# Altium project MB1430.PrjPcb (part 1 of 2)
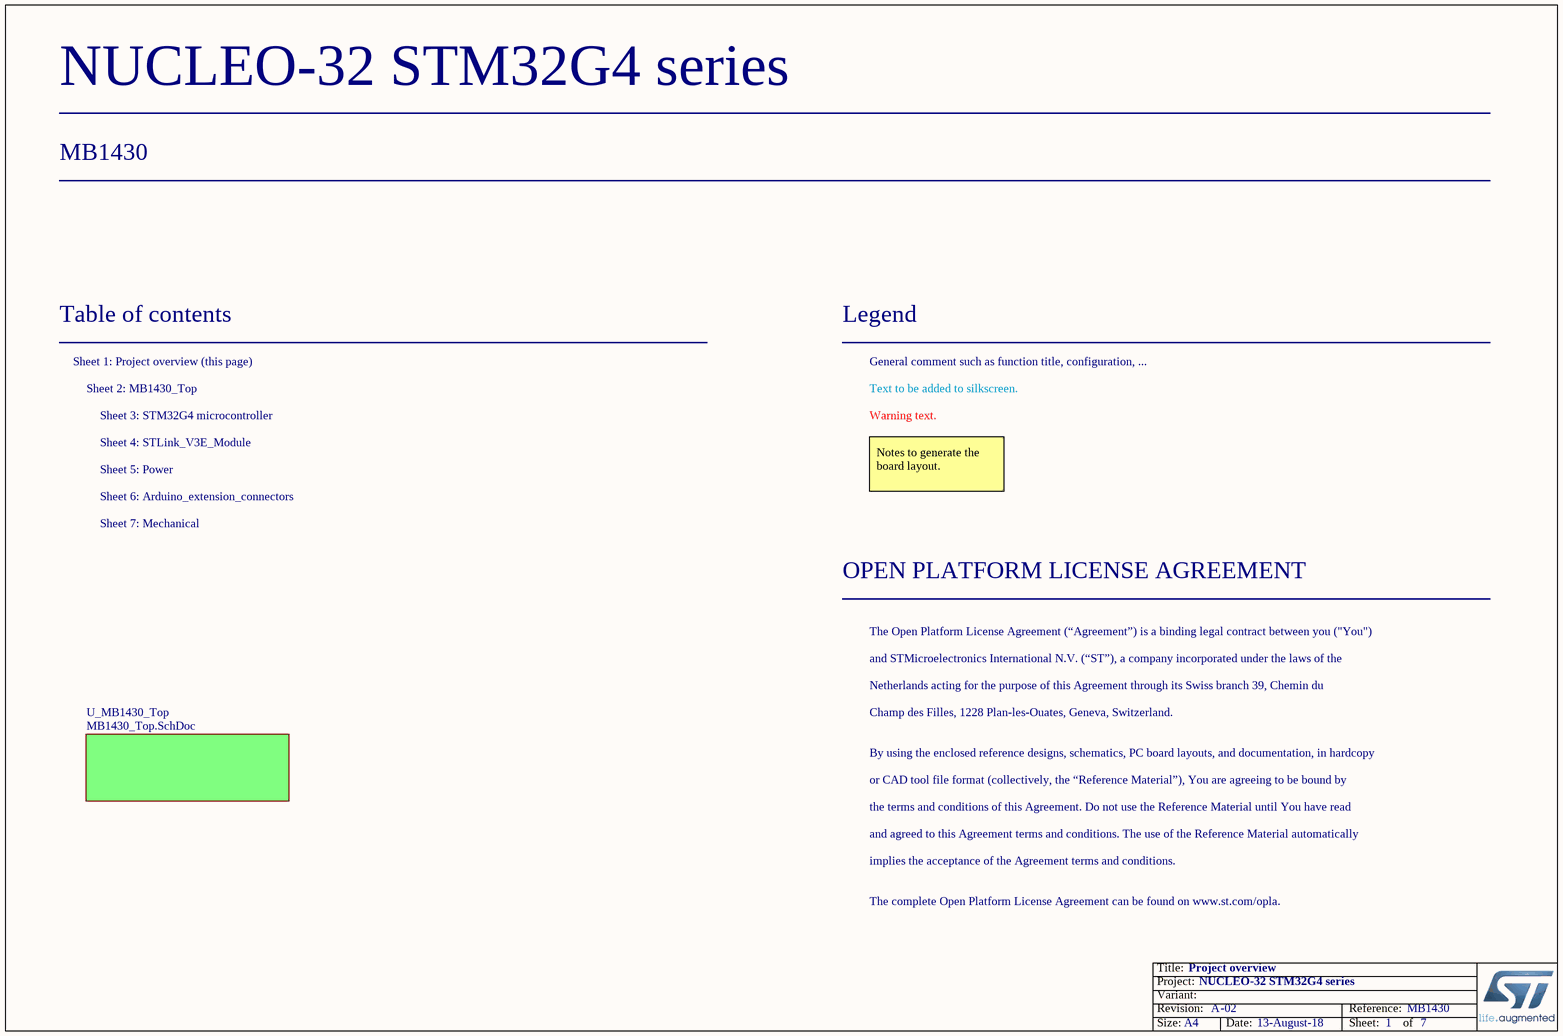
[diagram p0: Project_overview.SchDoc]
Board_Assembly_Revision: 02; Board_Document_Date: 13-August-18; Board_Name: NUCLEO-32 STM32G4 series; Board_PCB_Revision: A; Board_Reference: MB1430
7 sheets, 125 parts. Net scope: flat (ports and power ports of the same name join across sheets).
Board file: MB1430.PcbDoc
Sheets:
  Project_overview.SchDoc
    U_MB1430_Top = MB1430_Top.SchDoc
      U_Arduino_extension_connectors = Arduino_extension_connectors.SchDoc
      U_Power = Power.SchDoc
      U_STM32_microcontroller_IOs = STM32G4_microcontroller.SchDoc
      U_ST_LINK_V3E = STLink_V3E_Module.SchDoc
      Mechanical = Mechanical.SchDoc

## Sheet Project_overview.SchDoc: Project overview
size A4; Date: Not used; ApprovedBy: Not used; CheckedBy: Not used; Author: Not used; CompanyName: STMicroelectronics; DrawnBy: Not used; Engineer: Not used; Organization: Not used; Address1: Not used; Address2: Not used; Address3: Not used; Address4: Not used; DocumentNumber: Not used; Revision: Not used; SheetNumber: 1; SheetTotal: 7; CurrentTime: Not used; CurrentDate: Not used; Time: Not used; DocumentFullPathAndName: Not used; DocumentName: Not used; ModifiedDate: Not used; ImagePath: Not used; ProjectName: Not used; Application_BuildNumber: Not used

### Sub-sheets
U_MB1430_Top = MB1430_Top.SchDoc: no entries

### Notes on the sheet
- Table of contents
- Sheet 1: Project overview (this page)
- Legend
- General comment such as function title, configuration, ...
- Sheet 2: MB1430_Top
- Sheet 4: STLink_V3E_Module
- Sheet 3: STM32G4 microcontroller
- Text to be added to silkscreen.
- Warning text.
- Sheet 6: Arduino_extension_connectors
- Sheet 5: Power
- Notes to generate the board layout.
- Sheet 7: Mechanical
- OPEN PLATFORM LICENSE AGREEMENT
- The Open Platform License Agreement (“Agreement”) is a binding legal contract between you ("You")
- and STMicroelectronics International N.V. (“ST”), a company incorporated under the laws of the
- Netherlands acting for the purpose of this Agreement through its Swiss branch 39, Chemin du
- Champ des Filles, 1228 Plan-les-Ouates, Geneva, Switzerland.
- By using the enclosed reference designs, schematics, PC board layouts, and documentation, in hardcopy
- or CAD tool file format (collectively, the “Reference Material”), You are agreeing to be bound by
- the terms and conditions of this Agreement. Do not use the Reference Material until You have read
- and agreed to this Agreement terms and conditions. The use of the Reference Material automatically
- implies the acceptance of the Agreement terms and conditions.
- The complete Open Platform License Agreement can be found on www.st.com/opla.
- Title:
- Project:
- Size:
- Revision:
- Variant:
- A4
- -
- Date:
- Reference:
- Sheet:
- of

## Sheet MB1430_Top.SchDoc: Top hierarchical view
size A4; Date: Not used; ApprovedBy: Not used; CheckedBy: Not used; Author: Not used; CompanyName: STMicroelectronics; DrawnBy: Not used; Engineer: Not used; Organization: Not used; Address1: Not used; Address2: Not used; Address3: Not used; Address4: Not used; DocumentNumber: Not used; Revision: A-01-P3; SheetNumber: 2; SheetTotal: 7; CurrentTime: Not used; CurrentDate: Not used; Time: Not used; DocumentFullPathAndName: Not used; DocumentName: Not used; ModifiedDate: Not used; ImagePath: Not used; ProjectName: Not used; Application_BuildNumber: Not used
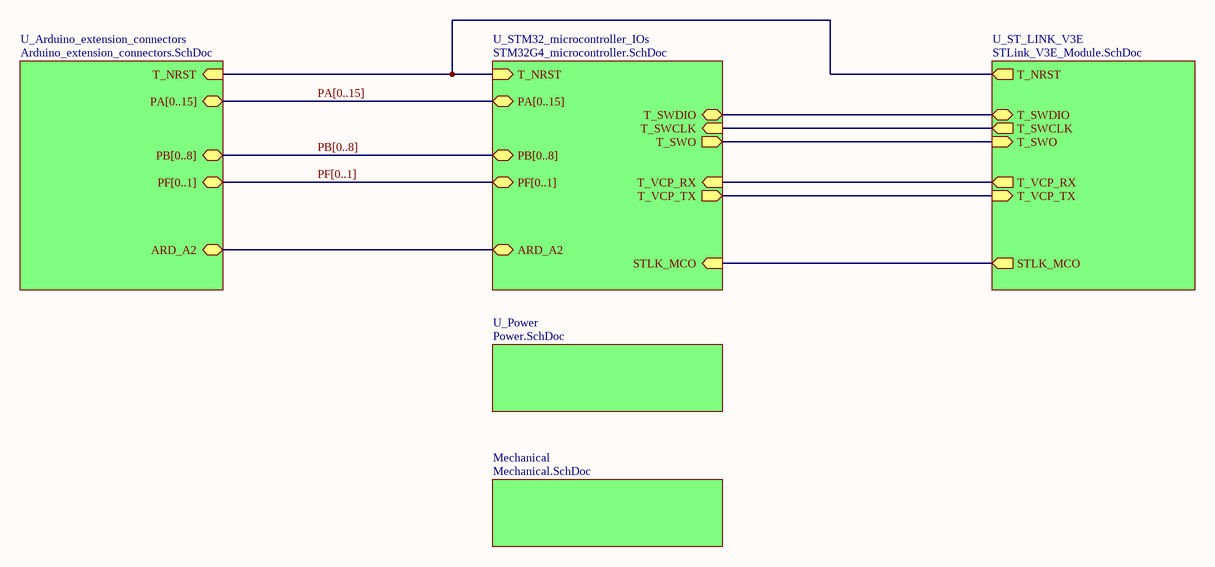
[diagram p1: MB1430_Top.SchDoc]

### Sub-sheets
Mechanical = Mechanical.SchDoc: no entries
U_Arduino_extension_connectors = Arduino_extension_connectors.SchDoc: PA[0..15] (bidir), PF[0..1] (bidir), T_NRST, PB[0..8] (bidir), ARD_A2
U_Power = Power.SchDoc: no entries
U_ST_LINK_V3E = STLink_V3E_Module.SchDoc: T_SWCLK, T_SWO, T_NRST, STLK_MCO, T_SWDIO, T_VCP_TX, T_VCP_RX
U_STM32_microcontroller_IOs = STM32G4_microcontroller.SchDoc: PA[0..15] (bidir), PF[0..1] (bidir), STLK_MCO, T_NRST, T_VCP_TX, T_VCP_RX, T_SWCLK, T_SWO, T_SWDIO, PB[0..8] (bidir), ARD_A2

### Nets
(unnamed): sheet U_Arduino_extension_connectors/T_NRST, sheet U_STM32_microcontroller_IOs/T_NRST, sheet U_ST_LINK_V3E/T_NRST
(unnamed): sheet U_Arduino_extension_connectors/ARD_A2, sheet U_STM32_microcontroller_IOs/ARD_A2
(unnamed): sheet U_STM32_microcontroller_IOs/STLK_MCO, sheet U_ST_LINK_V3E/STLK_MCO
(unnamed): sheet U_STM32_microcontroller_IOs/T_VCP_TX, sheet U_ST_LINK_V3E/T_VCP_TX
(unnamed): sheet U_STM32_microcontroller_IOs/T_VCP_RX, sheet U_ST_LINK_V3E/T_VCP_RX
(unnamed): sheet U_STM32_microcontroller_IOs/T_SWCLK, sheet U_ST_LINK_V3E/T_SWCLK
(unnamed): sheet U_STM32_microcontroller_IOs/T_SWO, sheet U_ST_LINK_V3E/T_SWO
(unnamed): sheet U_STM32_microcontroller_IOs/T_SWDIO, sheet U_ST_LINK_V3E/T_SWDIO

### Buses and harness runs
bus PA[0..15] = sheet U_Arduino_extension_connectors/PA[0..15] = sheet U_STM32_microcontroller_IOs/PA[0..15]
bus PB[0..8] = sheet U_Arduino_extension_connectors/PB[0..8] = sheet U_STM32_microcontroller_IOs/PB[0..8]
bus PF[0..1] = sheet U_Arduino_extension_connectors/PF[0..1] = sheet U_STM32_microcontroller_IOs/PF[0..1]

### Notes on the sheet
- Cuttable part on PCB
- Title:
- Project:
- Size:
- Revision:
- Variant:
- A4
- -
- Date:
- Reference:
- Sheet:
- of

## Sheet Arduino_extension_connectors.SchDoc: Arduino extension connectors
size A4; Date: Not used; ApprovedBy: Not used; CheckedBy: Not used; Author: Not used; CompanyName: STMicroelectronics; DrawnBy: Not used; Engineer: Not used; Organization: Not used; Address1: Not used; Address2: Not used; Address3: Not used; Address4: Not used; DocumentNumber: Not used; Revision: Not used; SheetNumber: 6; SheetTotal: 7; CurrentTime: Not used; CurrentDate: Not used; Time: Not used; DocumentFullPathAndName: Not used; DocumentName: Not used; ModifiedDate: Not used; ImagePath: Not used; ProjectName: Not used; Application_BuildNumber: Not used
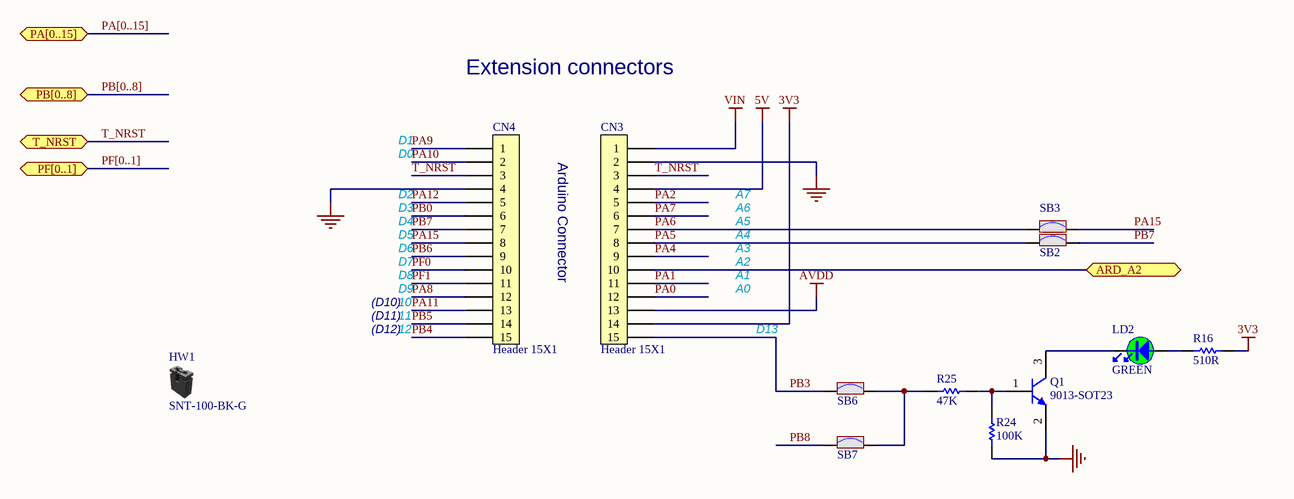
[diagram p2: Arduino_extension_connectors.SchDoc]

### Parts
CN3  value Header 15X1  [CON_LYCN_313115S161145]
CN4  value Header 15X1  [CON_LYCN_313115S161145]
HW1  value SNT-100-BK-G  (hidden comment: Shunt Black 2.54mm)  (mechanical)
LD2  value GREEN  [LED_0603_GREEN]
Q1  value 9013-SOT23  [NPN_SOT23]
R16  value 510R  [R0402]
R24  value 100K  [R0402]
R25  value 47K  [R0402]
SB2  (no value)  [SOLDER-BRIDGE_R0603-0R]
SB3  (no value)  [SOLDER-BRIDGE_R0603-0R]
SB6  (no value)  [SOLDER-BRIDGE_R0603-0R]
SB7  (no value)  [SOLDER-BRIDGE_R0603-0R]

### Ports
ARD_A2, PA[0..15] (bidir), PB[0..8] (bidir), PF[0..1] (bidir), T_NRST

### Nets
3V3: CN3.14 R16.2
5V: CN3.4
AVDD: CN3.13
GND: CN3.2 CN4.4 Q1.2(E) R24.1
VIN: CN3.1
ARD_A2: CN3.10 ; port ARD_A2
PA0: CN3.12
PA1: CN3.11
PA2: CN3.5
PA4: CN3.9
PA5: CN3.8 SB2.1
PA6: CN3.7 SB3.1
PA7: CN3.6
PA8: CN4.12
PA9: CN4.1
PA10: CN4.2
PA11: CN4.13
PA12: CN4.5
PA15: CN4.8 SB3.2
PB0: CN4.6
PB3: CN3.15 SB6.1
PB4: CN4.15
PB5: CN4.14
PB6: CN4.9
PB7: CN4.7 SB2.2
PB8: SB7.1
PF0: CN4.10
PF1: CN4.11
T_NRST: CN3.3 CN4.3 ; port T_NRST
NetLD2_1: LD2.1 R16.1
NetLD2_2: LD2.2 Q1.3(C)
NetQ1_1: Q1.1(B) R24.2 R25.2
NetR25_1: R25.1 SB6.2 SB7.2

### Buses and harness runs
bus PA[0..15] = port PA[0..15]
bus PB[0..8] = port PB[0..8]
bus PF[0..1] = port PF[0..1]

### Notes on the sheet
- Extension connectors
- D0
- D1
- D2
- Arduino Connector
- A7
- D4
- D3
- D5
- D6
- D7
- A2
- A3
- A4
- A5
- A6
- (D10)
- (D12)
- (D11)
- D8
- D9
- 10
- 12
- 11
- A0
- A1
- D13
- Title:
- Project:
- Size:
- Revision:
- Variant:
- -
- Date:
- Reference:
- Sheet:
- of

### Library data of the parts
CN3 CN4 = MCD-01332: Pin header, 15x1, 2,54mm, VR, TH, Height 6mm/6mm; Part_Type: Connector; Manufacturer_Part_Number: 313115S161145; Manufacturer: LYCN; Provided_By: SUBCO; Initial_Board_Reference: tbd; Remark: Official footprint by subcon done.; Internal_Part_Number: MCD-01332; Status: Footprint available; ComponentLink1Description: Datasheet; ComponentLink1URL: http://tunmcdsvn.tun.st.com/Component_Datasheet_Library/Trunk/Connectors/LYCN_3131xxS141
HW1 = MCD-00043: SHUNT 2.54mm BLACK; Part_Type: Mechanical; Manufacturer: SAMTEC; Provided_By: SUBCO; Internal_Part_Number: MCD-00043; Status: Released; Manufacturer_Part_Number: SNT-100-BK-G; ComponentLink1Description: Datasheet; ComponentLink1URL: http://tunmcdsvn.tun.st.com/Component_Datasheet_Library/Trunk/Connectors/Samtec_Shunt_Jumper_SNT100
LD2 = MCD-00050: LED, Green, 0603; Manufacturer_Part_Number: 19-213SYGC/S530-E2/TR8; Manufacturer: EVERLIGHT; Part_Type: Display; Provided_By: SUBCO; Initial_Board_Reference: MB1274; Internal_Part_Number: MCD-00050; ComponentLink1Description: Datasheet; Status: Released; ComponentLink1URL: http://tunmcdsvn.tun.st.com/Component_Datasheet_Library/Trunk/Display/Everlight_SMD-LED-GREEN_19-213SYGC-S530-XX-TR8-v3.doc; Package: LED 0603
Q1 = MCD-00073: NPN Bipolar Transistor; Part_Type: IC; Manufacturer_Part_Number: BSR14; Manufacturer: NXP; Provided_By: SUBCO; Initial_Board_Reference: MB1274; Revision: *; Internal_Part_Number: MCD-00073; Status: Released; ComponentLink1Description: Datasheet; ComponentLink1URL: http://tunmcdsvn.tun.st.com/Component_Datasheet_Library/Trunk/IC/NXP_Transistor_BSR14
R16 = MCD-00064: Resistor,510R,0402,1%,1/16W; Manufacturer_Part_Number: RC0402FR-07510RL; Manufacturer: YAGEO; Provided_By: SUBCO; Initial_Board_Reference: MB1274; Internal_Part_Number: MCD-00064; Status: Released; Part_Type: Resistor; Package: R0402; ComponentLink1Description: Datasheet; ComponentLink1URL: http://tunmcdsvn.tun.st.com/Component_Datasheet_Library/Trunk/Resistors/Yageo_Resistor_RC0402-series
R24 = MCD-00059: Resistor,100K,0402,1%,1/16W; Manufacturer_Part_Number: RC0402FR-07100KL; Manufacturer: YAGEO; Alternate_Manufacturer_Part_Number: RT0402FRE07100KL; Provided_By: SUBCO; Initial_Board_Reference: MB1274; Internal_Part_Number: MCD-00059; Status: Released; Part_Type: Resistor; Alternate_Manufacturer: YAGEO; Package: R0402; ComponentLink1Description: Datasheet; ComponentLink1URL: http://tunmcdsvn.tun.st.com/Component_Datasheet_Library/Trunk/Resistors/Yageo_Resistor_RC0402-series
R25 = MCD-00063: Resistor,47K,0402,1%,1/16W; Manufacturer_Part_Number: RC0402FR-0747KL; Manufacturer: YAGEO; Provided_By: SUBCO; Initial_Board_Reference: MB1274; Internal_Part_Number: MCD-00063; Status: Released; Part_Type: Resistor; Package: R0402; ComponentLink1Description: Datasheet; ComponentLink1URL: http://tunmcdsvn.tun.st.com/Component_Datasheet_Library/Trunk/Resistors/Yageo_Resistor_RC0402-series
SB2 SB3 SB6 SB7 = MCD-00071: Solder Bridge ON; Part_Type: Mechanical; Manufacturer_Part_Number: RC0603JR-070RL; Manufacturer: YAGEO; Provided_By: SUBCO; Initial_Board_Reference: MB1274; Internal_Part_Number: MCD-00071; Status: Released; ComponentLink1Description: Datasheet; Package: SB0603; ComponentLink1URL: http://tunmcdsvn.tun.st.com/Component_Datasheet_Library/Trunk/Resistors/Yageo_Resistor_RC0603-series

## Sheet Power.SchDoc: Power
size A4; Date: Not used; ApprovedBy: Not used; CheckedBy: Not used; Author: Not used; CompanyName: STMicroelectronics; DrawnBy: Not used; Engineer: Not used; Organization: Not used; Address1: Not used; Address2: Not used; Address3: Not used; Address4: Not used; DocumentNumber: Not used; Revision: Not used; SheetNumber: 5; SheetTotal: 7; CurrentTime: Not used; CurrentDate: Not used; Time: Not used; DocumentFullPathAndName: Not used; DocumentName: Not used; ModifiedDate: Not used; ImagePath: Not used; ProjectName: Not used; Application_BuildNumber: Not used
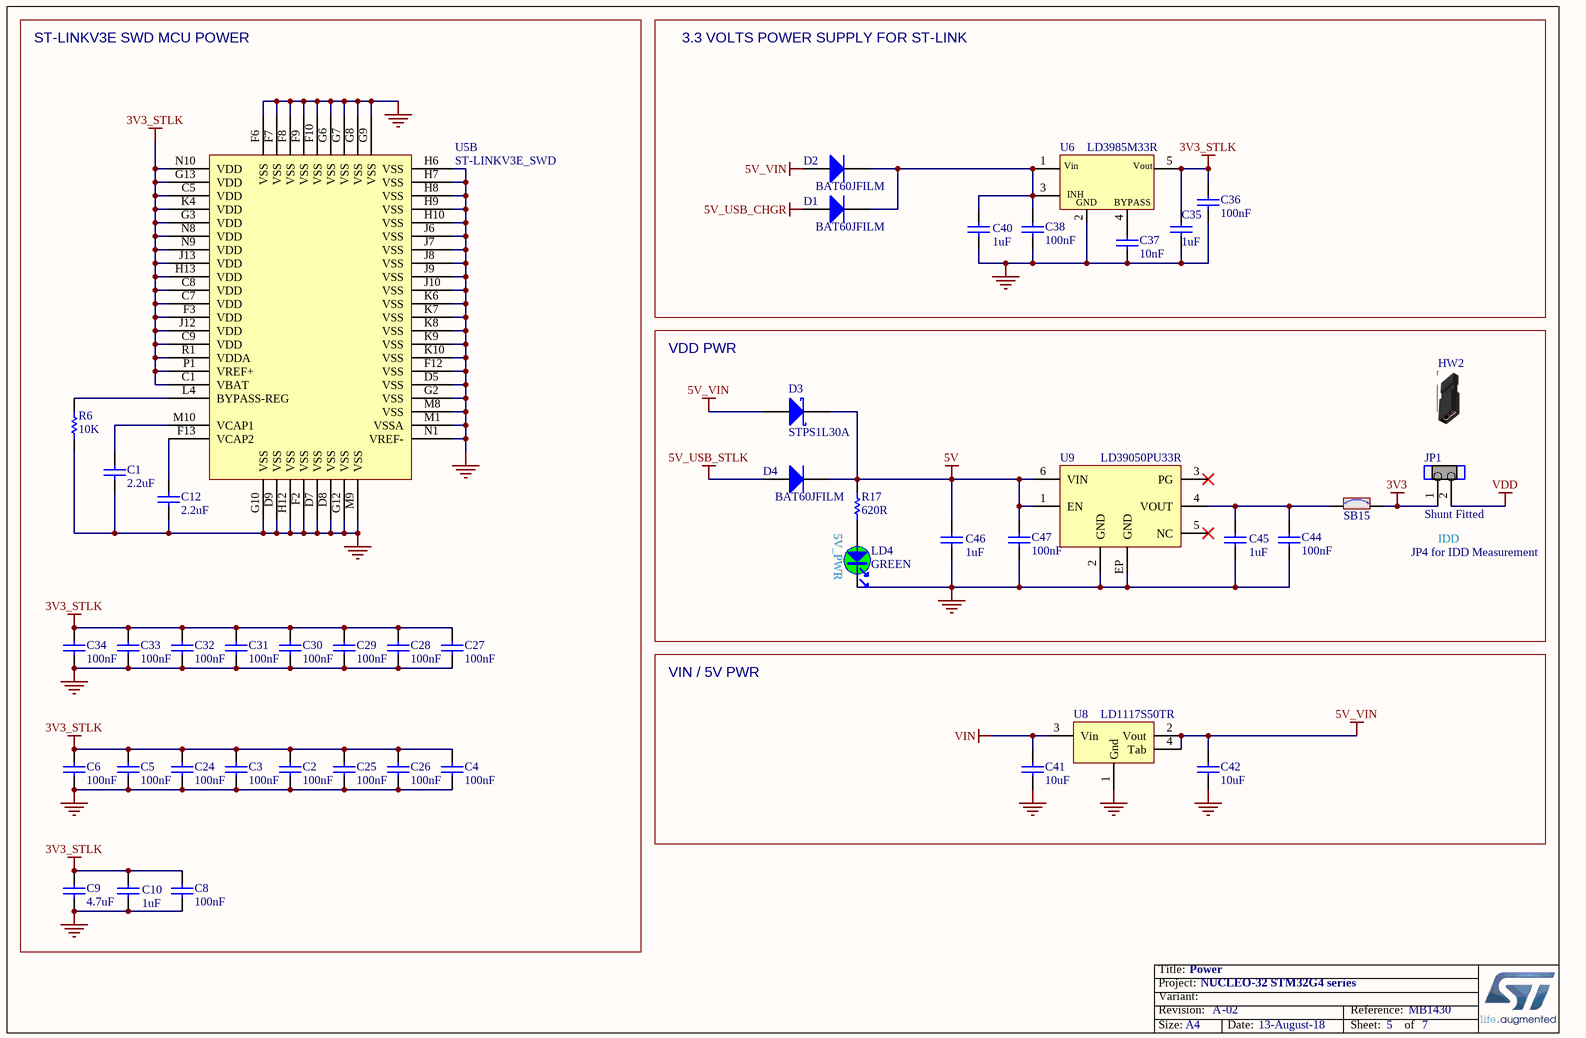
[diagram p3: Power.SchDoc]

### Parts
C1  value 2.2uF  [C0603]
C2  value 100nF  [C0402]
C3  value 100nF  [C0402]
C4  value 100nF  [C0402]
C5  value 100nF  [C0402]
C6  value 100nF  [C0402]
C8  value 100nF  [C0402]
C9  value 4.7uF  [C0603]
C10  value 1uF  [C0603]
C12  value 2.2uF  [C0603]
C24  value 100nF  [C0402]
C25  value 100nF  [C0402]
C26  value 100nF  [C0402]
C27  value 100nF  [C0402]
C28  value 100nF  [C0402]
C29  value 100nF  [C0402]
C30  value 100nF  [C0402]
C31  value 100nF  [C0402]
C32  value 100nF  [C0402]
C33  value 100nF  [C0402]
C34  value 100nF  [C0402]
C35  value 1uF  [C0603]
C36  value 100nF  [C0402]
C37  value 10nF  [C0402]
C38  value 100nF  [C0402]
C40  value 1uF  [C0603]
C41  value 10uF  [C0805]
C42  value 10uF  [C0805]
C44  value 100nF  [C0402]
C45  value 1uF  [C0603]
C46  value 1uF  [C0603]
C47  value 100nF  [C0402]
D1  value BAT60JFILM  [DIO_SOD323]
D2  value BAT60JFILM  [DIO_SOD323]
D3  value STPS1L30A  [DIO_SMA_1A_2K]
D4  value BAT60JFILM  [DIO_SOD323]
HW2  (no value)  (mechanical)
JP1  value Shunt Fitted  [CON_WP_707-2-02-2-20-00]
LD4  value GREEN  [LED_0603_GREEN]
R6  value 10K  [R0402]
R17  value 620R  [R0402]
SB15  (no value)  [SOLDER-BRIDGE_R0603-0R]
U5  value ST-LINKV3E_SWD  [ICC_UFBGA201_176+25_10X10_P065]  (part B of 2)
U6  value LD3985M33R  [REG_SOT23-5L]
U8  value LD1117S50TR  [REG_SOT223-TAB]
U9  value LD39050PU33R  [ICC_DFN6-EPAD_3X3_P095]

### Blocks framed on the sheet
ST-LINKV3E SWD MCU POWER: C1-C6 C8-C10 C12 C24-C34 R6 U5
3.3 VOLTS POWER SUPPLY FOR ST-LINK: C35-C38 C40 D1 D2 U6
VDD PWR: C44-C47 D3 D4 HW2 JP1 LD4 R17 SB15 U9
VIN / 5V PWR: C41 C42 U8

### Nets
3V3: JP1.1 SB15.2
3V3_STLK: C2.2 C3.2 C4.2 C5.2 C6.2 C8.2 C9.2 C10.2 C24.2 C25.2 C26.2 C27.2 C28.2 C29.2 C30.2 C31.2 C32.2 C33.2 C34.2 C35.2 C36.2 U5.C1(VBAT) U5.C5(VDD) U5.C7(VDD) U5.C8(VDD) U5.C9(VDD) U5.F3(VDD) U5.G3(VDD) U5.G13(VDD) U5.H13(VDD) U5.J12(VDD) U5.J13(VDD) U5.K4(VDD) U5.N8(VDD) U5.N9(VDD) U5.N10(VDD) U5.P1(VREF+) U5.R1(VDDA) U6.5(Vout)
5V: C46.2 C47.2 D3.2(K) D4.2(K) R17.2 U9.1(EN) U9.6(VIN)
5V_USB_CHGR: D1.1(A)
5V_USB_STLK: D4.1(A)
5V_VIN: C42.2 D2.1(A) D3.1(A) U8.2(Vout) U8.4(Tab)
GND: C1.1 C2.1 C3.1 C4.1 C5.1 C6.1 C8.1 C9.1 C10.1 C12.1 C24.1 C25.1 C26.1 C27.1 C28.1 C29.1 C30.1 C31.1 C32.1 C33.1 C34.1 C35.1 C36.1 C37.1 C38.1 C40.1 C41.1 C42.1 C44.1 C45.1 C46.1 C47.1 LD4.2 R6.1 U5.D5(VSS) U5.D7(VSS) U5.D8(VSS) U5.D9(VSS) U5.F2(VSS) U5.F6(VSS) U5.F7(VSS) U5.F8(VSS) U5.F9(VSS) U5.F10(VSS) U5.F12(VSS) U5.G2(VSS) U5.G6(VSS) U5.G7(VSS) U5.G8(VSS) U5.G9(VSS) U5.G10(VSS) U5.G12(VSS) U5.H6(VSS) U5.H7(VSS) U5.H8(VSS) U5.H9(VSS) U5.H10(VSS) U5.H12(VSS) U5.J6(VSS) U5.J7(VSS) U5.J8(VSS) U5.J9(VSS) U5.J10(VSS) U5.K6(VSS) U5.K7(VSS) U5.K8(VSS) U5.K9(VSS) U5.K10(VSS) U5.M1(VSSA) U5.M8(VSS) U5.M9(VSS) U5.N1(VREF-) U6.2(GND) U8.1(Gnd) U9.2(GND) U9.EP(GND)
VDD: JP1.2
VIN: C41.2 U8.3(Vin)
NetC1_2: C1.2 U5.M10(VCAP1)
NetC12_2: C12.2 U5.F13(VCAP2)
NetC37_2: C37.2 U6.4(BYPASS)
NetC38_2: C38.2 C40.2 D1.2(K) D2.2(K) U6.1(Vin) U6.3(CE)
NetC44_2: C44.2 C45.2 SB15.1 U9.4(VOUT)
NetLD4_1: LD4.1 R17.1
NetR6_2: R6.2 U5.L4(BYPASS-REG)

Not connected (* = marked no-connect by the designer): U9 3(PG)* 5(NC)*

### Notes on the sheet
- 5V_PWR
- JP4 for IDD Measurement
- IDD
- Title:
- Project:
- Size:
- Revision:
- Variant:
- A4
- -
- Date:
- Reference:
- Sheet:
- of
- (in symbol MCD-00086) INH

### Library data of the parts
C1 C12 = MCD-00012: Capacitor, MLCC, 2.2uF, 10V, X5R, 10%, 0603, T=0,8mm; Manufacturer_Part_Number: CC0603KRX5R6BB225; Manufacturer: YAGEO; Alternate_Manufacturer_Part_Number: C0603C225K8PACTU; Alternate_Manufacturer: KEMET; Provided_By: SUBCO; Initial_Board_Reference: MB1274; Internal_Part_Number: MCD-00012; Status: Released; Part_Type: Capacitor; Package: C0603; ComponentLink1Description: Datasheet; ComponentLink1URL: http://tunmcdsvn.tun.st.com/Component_Datasheet_Library/Trunk/Capacitors/Yageo_Multilayer_capacitor_X5R_series_100pF_to_100uF
C2-C6 C8 C24-C34 C36 C38 C44 C47 = MCD-00102: Capacitor, MLCC, 100nF, 16V, X7R, 10%, 0402, T=0,5mm; Manufacturer_Part_Number: CC0402KRX7R7BB104; Manufacturer: YAGEO; Provided_By: SUBCO; Initial_Board_Reference: MB1262; Internal_Part_Number: MCD-00102; Status: Released; Package: C0402; ComponentLink1Description: Datasheet; Part_Type: Capacitor; ComponentLink1URL: http://tunmcdsvn.tun.st.com/Component_Datasheet_Library/Trunk/Capacitors/Yageo_Multilayer_Capacitor_X7R_series_100pF_to_22uF
C9 = MCD-00009: Capacitor, MLCC, 4.7uF, 16V, X5R, 10%, 0603, T=0.8mm; Manufacturer_Part_Number: CC0603KRX5R7BB475; Manufacturer: YAGEO; Provided_By: SUBCO; Initial_Board_Reference: MB1274; Internal_Part_Number: MCD-00009; Status: Released; Part_Type: Capacitor; Package: C0603; ComponentLink1Description: Datasheet; ComponentLink1URL: http://tunmcdsvn.tun.st.com/Component_Datasheet_Library/Trunk/Capacitors/Yageo_Multilayer_capacitor_X5R_series_100pF_to_100uF
C10 C35 C40 C45 C46 = MCD-00010: Capacitor, MLCC, 1uF, 16V, X5R, 10%, 0603, T=0,8mm; Manufacturer_Part_Number: CC0603KRX5R7BB105; Manufacturer: YAGEO; Provided_By: SUBCO; Initial_Board_Reference: MB1274; Internal_Part_Number: MCD-00010; Status: Released; Package: C0603; ComponentLink1Description: Datasheet; Part_Type: Capacitor; ComponentLink1URL: http://tunmcdsvn.tun.st.com/Component_Datasheet_Library/Trunk/Capacitors/Yageo_Multilayer_capacitor_X5R_series_100pF_to_100uF
C37 = MCD-00011: Capacitor, MLCC, 10nF, 16V, X7R, 10%, 0402, T=0.5mm; Manufacturer_Part_Number: CC0402KRX7R7BB103; Manufacturer: YAGEO; Provided_By: SUBCO; Initial_Board_Reference: MB1274; Internal_Part_Number: MCD-00011; Status: Released; Part_Type: Capacitor; Package: C0402; ComponentLink1Description: Datasheet; ComponentLink1URL: http://tunmcdsvn.tun.st.com/Component_Datasheet_Library/Trunk/Capacitors/Yageo_Multilayer_Capacitor_X7R_series_100pF_to_22uF
C41 C42 = MCD-00014: Capacitor, MLCC, 10uF, 25V, X5R, 10%, 0805, T=0,85mm; Manufacturer_Part_Number: CC0805KRX5R8BB106; Manufacturer: YAGEO; Provided_By: SUBCO; Initial_Board_Reference: MB1274; Internal_Part_Number: MCD-00014; ComponentLink1Description: Datasheet; Status: Released; Part_Type: Capacitor; Package: C0805; ComponentLink1URL: http://tunmcdsvn.tun.st.com/Component_Datasheet_Library/Trunk/Capacitors/Yageo_Multilayer_capacitor_X5R_series_100pF_to_100uF
D1 D2 D4 = MCD-00034: BAT60JFILM; Manufacturer: STMICROELECTRONICS; Part_Type: Diode; BMS_Part_Number: 9151097; Provided_By: SUBCO with ST control; Initial_Board_Reference: MB1274; Internal_Part_Number: MCD-00034; Status: Released; Manufacturer_Part_Number: BAT60JFILM; ComponentLink1Description: Datasheet; ComponentLink1URL: http://tunmcdsvn.tun.st.com/Component_Datasheet_Library/Trunk/Diodes/STM_Diode_BAT60JFILM-SOD323
D3 = MCD-01059: LOW DROP POWER SCHOTTKY RECTIFIER 1A 30V VF=0.3V; Part_Type: Diode; Manufacturer: STMICROELECTRONICS; Provided_By: SUBCO with ST control; Initial_Board_Reference: MB1378; Internal_Part_Number: MCD-01059; Status: Footprint available; Manufacturer_Part_Number: STPS1L30A; Package: DIO_SMA_1A_2K; ComponentLink1Description: Datasheet; ComponentLink1URL: http://tunmcdsvn.tun.st.com/Component_Datasheet_Library/Trunk/Diodes/STM_SCHOTTKY_STPS1L30
HW2 = MCD-01409: SHUNT 1.27mm BLACK; Part_Type: Mechanical; Manufacturer: W & P Products; Alternate_Manufacturer_Part_Number: M50-1900005; Alternate_Manufacturer: HARWIN; Value: 266-101-10-00; Provided_By: SUBCO; Initial_Board_Reference: MB1441; Remark: mechanical parts no footprint. alt MCD-01389; Internal_Part_Number: MCD-01409; Status: Checked; Manufacturer_Part_Number: 266-101-10-00; ComponentLink1Description: Datasheet; ComponentLink1URL: http://tunmcdsvn.tun.st.com/Component_Datasheet_Library/Trunk/Connectors/WPPRO_Shunt_Jumper_266
JP1 = MCD-01428: Header, 2x1, 1,27mm, Right Angled, Single Row, Height 3.05mm/1.27mm; Part_Type: Connector; Manufacturer_Part_Number: 707-2-02-2-20-00; Manufacturer: W & P Products; Provided_By: SUBCO; Initial_Board_Reference: MB1441; Internal_Part_Number: MCD-01428; Status: Checked; ComponentLink1Description: Datasheet; ComponentLink1URL: http://tunmcdsvn.tun.st.com/Component_Datasheet_Library/Trunk/Connectors/WPPRO_connector_707-series
LD4 = MCD-00050: LED, Green, 0603; Part_Type: Display; Manufacturer_Part_Number: 19-213SYGC/S530-E2/TR8; Manufacturer: EVERLIGHT; Provided_By: SUBCO; Initial_Board_Reference: MB1274; Internal_Part_Number: MCD-00050; Status: Released; Package: LED 0603; ComponentLink1Description: Datasheet; ComponentLink1URL: http://tunmcdsvn.tun.st.com/Component_Datasheet_Library/Trunk/Display/Everlight_SMD-LED-GREEN_19-213SYGC-S530-XX-TR8-v3.doc
R6 = MCD-00053: Resistor,10K,0402,1%,1/16W; Manufacturer_Part_Number: RC0402FR-0710KL; Manufacturer: YAGEO; Provided_By: SUBCO; Initial_Board_Reference: MB1274; Internal_Part_Number: MCD-00053; Status: Released; ComponentLink1Description: Datasheet; Part_Type: Resistor; Package: R0402; ComponentLink1URL: http://tunmcdsvn.tun.st.com/Component_Datasheet_Library/Trunk/Resistors/Yageo_Resistor_RC0402-series
R17 = MCD-00499: Resistor,620R,0402,1%,1/16W; Manufacturer_Part_Number: RC0402FR-07620RL; Manufacturer: YAGEO; Provided_By: SUBCO; Initial_Board_Reference: MBxxxx; Internal_Part_Number: MCD-00499; Status: Released; Part_Type: Resistor; Package: R0402; ComponentLink1Description: Datasheet; ComponentLink1URL: http://tunmcdsvn.tun.st.com/Component_Datasheet_Library/Trunk/Resistors/Yageo_Resistor_RC0402-series
SB15 = MCD-00071: as SB2 on sheet Arduino_extension_connectors; Internal_Part_Number: MCD-00071; Status: Released; ComponentLink1Description: Datasheet; Package: SB0603; ComponentLink1URL: http://tunmcdsvn.tun.st.com/Component_Datasheet_Library/Trunk/Resistors/Yageo_Resistor_RC0603-series
U5 = MCD-00596: STM32F723IEK  (STM32F7) BGA176; Part_Type: IC; Manufacturer_Part_Number: STM32F723IEK6; Manufacturer: STMICROELECTRONICS; BMS_Part_Number: 9175300; Provided_By: SUBCO with ST control; Initial_Board_Reference: MB1331; Internal_Part_Number: MCD-00596; Status: Checked; ComponentLink1Description: Datasheet; ComponentLink1URL: http://tunmcdsvn.tun.st.com/Component_Datasheet_Library/Trunk/IC/BGA176+25L_10x10x0.6_pitch0.65
U6 = MCD-00086: Ultra low drop-low noise BiCMOS voltage, regulators low ESR capacitors compatible; Manufacturer: STMICROELECTRONICS; Part_Type: IC; BMS_Part_Number: 9176161; Provided_By: SUBCO with ST control; Initial_Board_Reference: MB1274; Internal_Part_Number: MCD-00086; Status: Released; Manufacturer_Part_Number: LD3985M33R; ComponentLink1Description: Datasheet; ComponentLink1URL: http://tunmcdsvn.tun.st.com/Component_Datasheet_Library/Trunk/IC/STM_LDO_LD3985
U8 = MCD-00088: IC REG LDO 5V 0.8A SOT223; Manufacturer: STMICROELECTRONICS; BMS_Part_Number: 9176133; Provided_By: SUBCO with ST control; Initial_Board_Reference: MB1274; Internal_Part_Number: MCD-00088; Manufacturer_Part_Number: LD1117S50TR; ComponentLink1Description: Datasheet; Status: Released; Part_Type: IC; ComponentLink1URL: http://tunmcdsvn.tun.st.com/Component_Datasheet_Library/Trunk/IC/STM_LDO_LD1117; Package: SOT-223
U9 = MCD-00215: Low quiescent current and low noise voltage regulators; Manufacturer: STMICROELECTRONICS; Part_Type: IC; Provided_By: SUBCO with ST control; Initial_Board_Reference: MB1319; Internal_Part_Number: MCD-00215; Manufacturer_Part_Number: LD39050PU33R; Status: Released; ComponentLink1Description: Datasheet; ComponentLink1URL: http://tunmcdsvn.tun.st.com/Component_Datasheet_Library/Trunk/IC/STM_LDO_LD39050PU; Package: DFN6 3x3mm

## Sheet STM32G4_microcontroller.SchDoc: STM32G4 microcontroller
size A4; Date: Not used; ApprovedBy: Not used; CheckedBy: Not used; Author: Not used; CompanyName: STMicroelectronics; DrawnBy: Not used; Engineer: Not used; Organization: Not used; Address1: Not used; Address2: Not used; Address3: Not used; Address4: Not used; DocumentNumber: Not used; Revision: Not used; SheetNumber: 3; SheetTotal: 7; CurrentTime: Not used; CurrentDate: Not used; Time: Not used; DocumentFullPathAndName: Not used; DocumentName: Not used; ModifiedDate: Not used; ImagePath: Not used; ProjectName: Not used; Application_BuildNumber: Not used
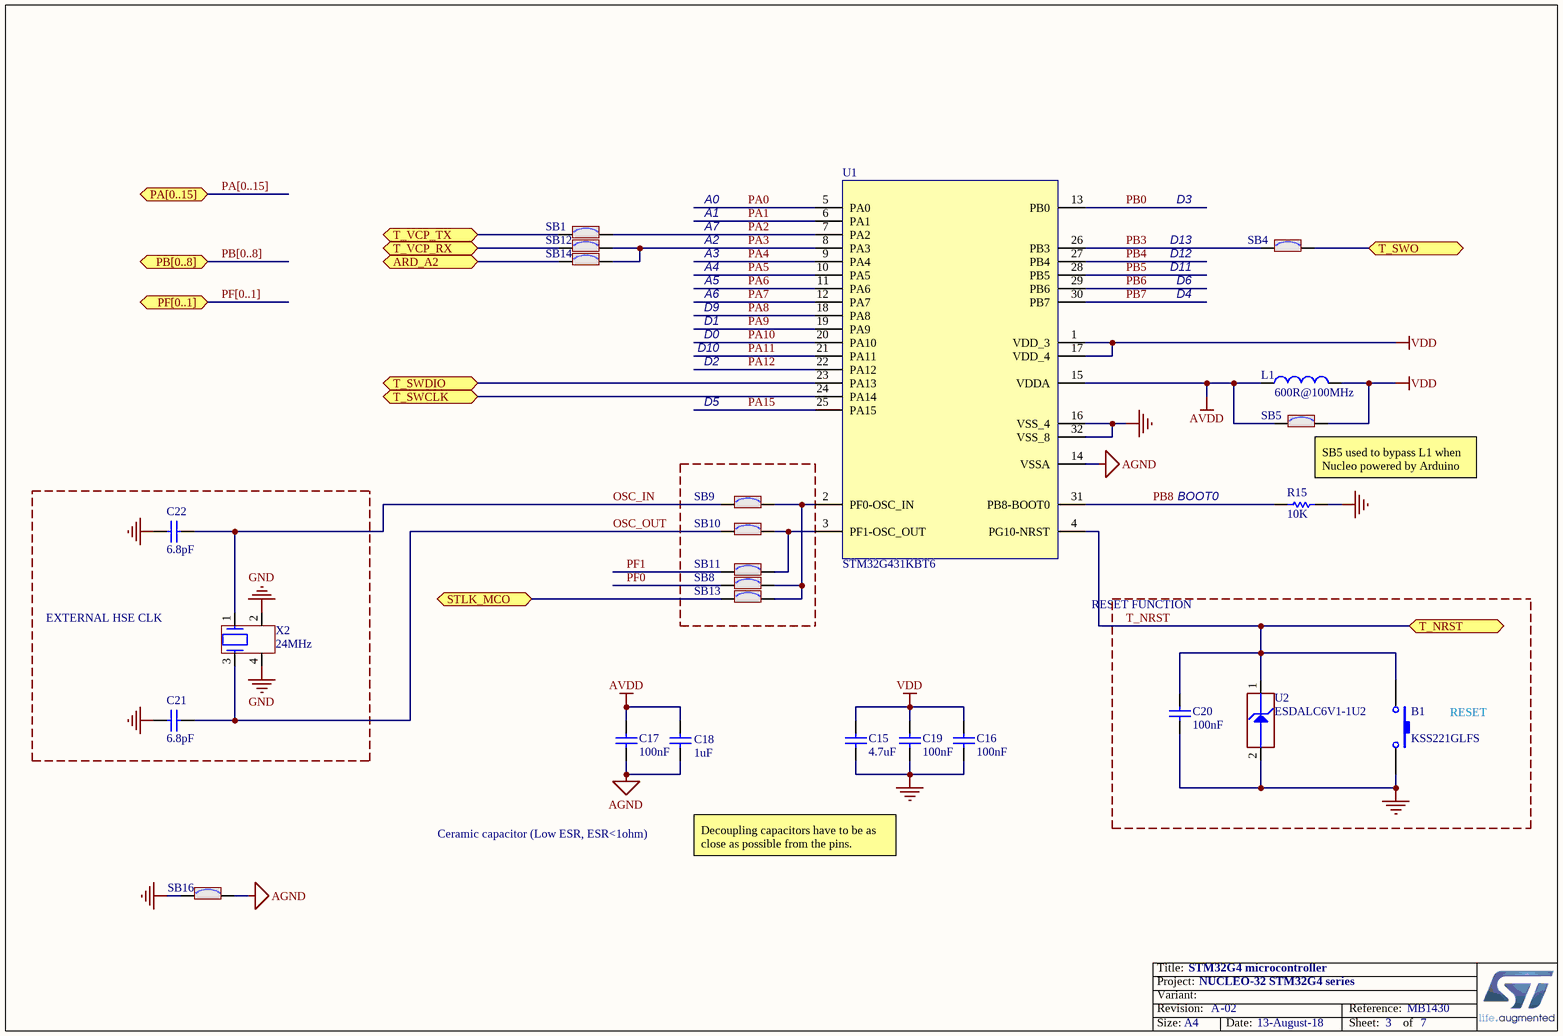
[diagram p4: STM32G4_microcontroller.SchDoc]

### Parts
B1  value KSS221GLFS  [SWI_C&K_ITT_KSS221G]
C15  value 4.7uF  [C0603]
C16  value 100nF  [C0402]
C17  value 100nF  [C0402]
C18  value 1uF  [C0603]
C19  value 100nF  [C0402]
C20  value 100nF  [C0402]
C21  value 6.8pF  [C0402]
C22  value 6.8pF  [C0402]
L1  value 600R@100MHz  [L0603]
R15  value 10K  [R0603]
SB1  (no value)  [SOLDER-BRIDGE_R0603-0R]
SB4  (no value)  [SOLDER-BRIDGE_R0603-0R]
SB5  (no value)  [SOLDER-BRIDGE_R0603-0R]
SB8  (no value)  [SOLDER-BRIDGE_R0603-0R]
SB9  (no value)  [SOLDER-BRIDGE_R0603-0R]
SB10  (no value)  [SOLDER-BRIDGE_R0603-0R]
SB11  (no value)  [SOLDER-BRIDGE_R0603-0R]
SB12  (no value)  [SOLDER-BRIDGE_R0603-0R]
SB13  (no value)  [SOLDER-BRIDGE_R0603-0R]
SB14  (no value)  [SOLDER-BRIDGE_R0603-0R]
SB16  (no value)  [SOLDER-BRIDGE_R0603-0R]
U1  value STM32G431KBT6  [ICC_LQFP32_7X7_P080__UFQFPN32-EPAD_5X5_P050__DI]
U2  value ESDALC6V1-1U2  [ESD_ST0201]
X2  value 24MHz  [CRY_NX2016SA_4P]

### Blocks framed on the sheet
EXTERNAL HSE CLK: C21 C22 X2

### Ports
ARD_A2, PA[0..15] (bidir), PB[0..8] (bidir), PF[0..1] (bidir), STLK_MCO, T_NRST, T_SWCLK, T_SWDIO, T_SWO, T_VCP_RX, T_VCP_TX

### Nets
AGND: C17.1 C18.1 SB16.2 U1.14(VSSA)
AVDD: C17.2 C18.2 L1.1 SB5.1 U1.15(VDDA)
GND: B1.2 C15.1 C16.1 C19.1 C20.1 C21.1 C22.1 R15.1 SB16.1 U1.16(VSS_4) U1.32(VSS_8) U2.2(GND) X2.2 X2.4
VDD: C15.2 C16.2 C19.2 L1.2 SB5.2 U1.1(VDD_3) U1.17(VDD_4)
ARD_A2: SB14.1 ; port ARD_A2
OSC_IN: C22.2 SB9.1 X2.1
OSC_OUT: C21.2 SB10.1 X2.3
PA0: U1.5(PA0)
PA1: U1.6(PA1)
PA2: SB1.2 U1.7(PA2)
PA3: SB12.2 SB14.2 U1.8(PA3)
PA4: U1.9(PA4)
PA5: U1.10(PA5)
PA6: U1.11(PA6)
PA7: U1.12(PA7)
PA8: U1.18(PA8)
PA9: U1.19(PA9)
PA10: U1.20(PA10)
PA11: U1.21(PA11)
PA12: U1.22(PA12)
PA15: U1.25(PA15)
PB0: U1.13(PB0)
PB3: SB4.1 U1.26(PB3)
PB4: U1.27(PB4)
PB5: U1.28(PB5)
PB6: U1.29(PB6)
PB7: U1.30(PB7)
PB8: R15.2 U1.31(PB8-BOOT0)
PF0: SB8.1
PF1: SB11.1
STLK_MCO: SB13.1 ; port STLK_MCO
T_NRST: B1.1 C20.2 U1.4(PG10-NRST) U2.1(IO1) ; port T_NRST
T_SWCLK: U1.24(PA14) ; port T_SWCLK
T_SWDIO: U1.23(PA13) ; port T_SWDIO
T_SWO: SB4.2 ; port T_SWO
T_VCP_RX: SB12.1 ; port T_VCP_RX
T_VCP_TX: SB1.1 ; port T_VCP_TX
NetSB8_2: SB8.2 SB9.2 SB13.2 U1.2(PF0-OSC_IN)
NetSB10_2: SB10.2 SB11.2 U1.3(PF1-OSC_OUT)

### Buses and harness runs
bus PA[0..15] = port PA[0..15]
bus PB[0..8] = port PB[0..8]
bus PF[0..1] = port PF[0..1]

### Notes on the sheet
- A0
- A1
- A2
- A7
- D13
- D3
- D9
- A3
- A4
- A5
- A6
- D12
- D11
- D4
- D6
- D1
- D0
- D10
- D2
- D5
- (near R15) BOOT0
- (near SB5) SB5 used to bypass L1 when Nucleo powered by Arduino AVDD.
- RESET FUNCTION
- RESET
- Ceramic capacitor (Low ESR, ESR<1ohm)
- Decoupling capacitors have to be as close as possible from the pins.
- Title:
- Project:
- Size:
- Revision:
- Variant:
- -
- Date:
- Reference:
- Sheet:
- of

### Library data of the parts
B1 = MCD-01335: Subminiature Side Actuated Tact Switch for SMT - KSS series - 2.0 Newtons - Gull wing, SPST; Part_Type: Misc; Manufacturer: C&K; Provided_By: SUBCO; Initial_Board_Reference: MB1430; Internal_Part_Number: MCD-01335; Status: Checked; Manufacturer_Part_Number: KSS221GLFS; ComponentLink1Description: Datasheet; ComponentLink1URL: http://tunmcdsvn.tun.st.com/Component_Datasheet_Library/Trunk/Misc/C&K_switch_button_KSS221GLFS/C&K_SWITCH_KSS221GLFS.pdf
C15 = MCD-00009: as C9 on sheet Power; Internal_Part_Number: MCD-00009; ComponentLink1Description: Datasheet; Status: Released; Part_Type: Capacitor; Package: C0603; ComponentLink1URL: http://tunmcdsvn.tun.st.com/Component_Datasheet_Library/Trunk/Capacitors/Yageo_Multilayer_capacitor_X5R_series_100pF_to_100uF
C16 C17 C19 C20 = MCD-00102: as C2 on sheet Power; Internal_Part_Number: MCD-00102; Status: Released; Package: C0402; ComponentLink1Description: Datasheet; Part_Type: Capacitor; ComponentLink1URL: http://tunmcdsvn.tun.st.com/Component_Datasheet_Library/Trunk/Capacitors/Yageo_Multilayer_Capacitor_X7R_series_100pF_to_22uF
C18 = MCD-00010: as C10 on sheet Power; Internal_Part_Number: MCD-00010; Status: Released; Package: C0603; ComponentLink1Description: Datasheet; Part_Type: Capacitor; ComponentLink1URL: http://tunmcdsvn.tun.st.com/Component_Datasheet_Library/Trunk/Capacitors/Yageo_Multilayer_capacitor_X5R_series_100pF_to_100uF
C21 C22 = MCD-00674: Capacitor, MLCC, 6.8pF, 50V, NPO, +-0.25pF, 0402, T=0.5mm; Manufacturer_Part_Number: CC0402CRNPO9BN6R8; Manufacturer: YAGEO; Provided_By: SUBCO; Initial_Board_Reference: MB1319; Internal_Part_Number: MCD-00674; Status: Released; Part_Type: Capacitor; Package: C0402; ComponentLink1Description: Datasheet; ComponentLink1URL: http://tunmcdsvn.tun.st.com/Component_Datasheet_Library/Trunk/Capacitors/Yageo_Capacitor_NP0_16V-to-50V
L1 = MCD-00047: SMD Chip ferrite bead, 600R@100MHz +/-25%, 350mA, 500mohm DC, 0603, T=0.8mm; Part_Type: Inductor; Manufacturer_Part_Number: FCM1608KF-601T03; Manufacturer: TAI-TECH; Provided_By: SUBCO; Initial_Board_Reference: MB1274; Internal_Part_Number: MCD-00047; Status: Released; ComponentLink1Description: Datasheet; ComponentLink1URL: http://tunmcdsvn.tun.st.com/Component_Datasheet_Library/Trunk/Inductors/TaiTech_Bead_FCM1608_series
R15 = MCD-00220: Resistor,10K,0603,1%,1/10W; Manufacturer_Part_Number: RC0603FR-0710KL; Manufacturer: YAGEO; Provided_By: SUBCO; Initial_Board_Reference: MB1319; Internal_Part_Number: MCD-00220; ComponentLink1Description: Datasheet; Status: Released; Part_Type: Resistor; Package: R0603; ComponentLink1URL: http://tunmcdsvn.tun.st.com/Component_Datasheet_Library/Trunk/Resistors/Yageo_Resistor_RC0603-series
SB1 SB4 SB5 SB8-SB14 SB16 = MCD-00071: as SB2 on sheet Arduino_extension_connectors; Internal_Part_Number: MCD-00071; Status: Released; ComponentLink1Description: Datasheet; Package: SB0603; ComponentLink1URL: http://tunmcdsvn.tun.st.com/Component_Datasheet_Library/Trunk/Resistors/Yageo_Resistor_RC0603-series
U1 = MCD-01396: STM32G431, LQFP32 package, with double footprint (LQFP32_5V & UFQFPN32_A0B8); Part_Type: IC; Manufacturer: STMICROELECTRONICS; Provided_By: SUBCO with ST control; Initial_Board_Reference: MB1430; Internal_Part_Number: MCD-01396; Status: Checked; Manufacturer_Part_Number: STM32G431KBT6; Package: LQFP32-5V; ComponentLink1Description: Datasheet; ComponentLink1URL: http://tunmcdsvn.tun.st.com/Component_Datasheet_Library/Trunk/IC/STM_MCU_STM32G4xx
U2 = MCD-00170: ESD protection 6V1; Part_Type: Diode; Manufacturer: STMICROELECTRONICS; BMS_Part_Number: 9151132; Provided_By: SUBCO with ST control; Initial_Board_Reference: MB1274; Internal_Part_Number: MCD-00170; Status: Released; Manufacturer_Part_Number: ESDALC6V1-1U2; ComponentLink1Description: Datasheet; ComponentLink1URL: http://tunmcdsvn.tun.st.com/Component_Datasheet_Library/Trunk/Diodes/STM_ESD_ESDALC6V1-1U2
X2 = MCD-01036: 24MHz crystal oscillator - Cl:6pf -; Part_Type: Crystal_Osc; Manufacturer_Part_Number: NX2016SA 24MHz EXS00A-CS10820; Manufacturer: NDK; Provided_By: ST; Initial_Board_Reference: MB1332; Internal_Part_Number: MCD-01036; Status: Checked; Package: (2016) 2.0 x 1.6 x 0.45 mm; ComponentLink1Description: Datasheet; ComponentLink1URL: http://tunmcdsvn.tun.st.com/Component_Datasheet_Library/Trunk/Crystal_Osc/NDK_NX2016SA 24MHz EXS00A-CS10820 (EXS10B-27366B)

## Sheet STLink_V3E_Module.SchDoc: STLink V3E Module
size A4; Date: Not used; ApprovedBy: Not used; CheckedBy: Not used; Author: Not used; CompanyName: STMicroelectronics; DrawnBy: Not used; Engineer: Not used; Organization: Not used; Address1: Not used; Address2: Not used; Address3: Not used; Address4: Not used; DocumentNumber: Not used; Revision: Not used; SheetNumber: 4; SheetTotal: 7; CurrentTime: Not used; CurrentDate: Not used; Time: Not used; DocumentFullPathAndName: Not used; DocumentName: Not used; ModifiedDate: Not used; ImagePath: Not used; ProjectName: Not used; Application_BuildNumber: Not used
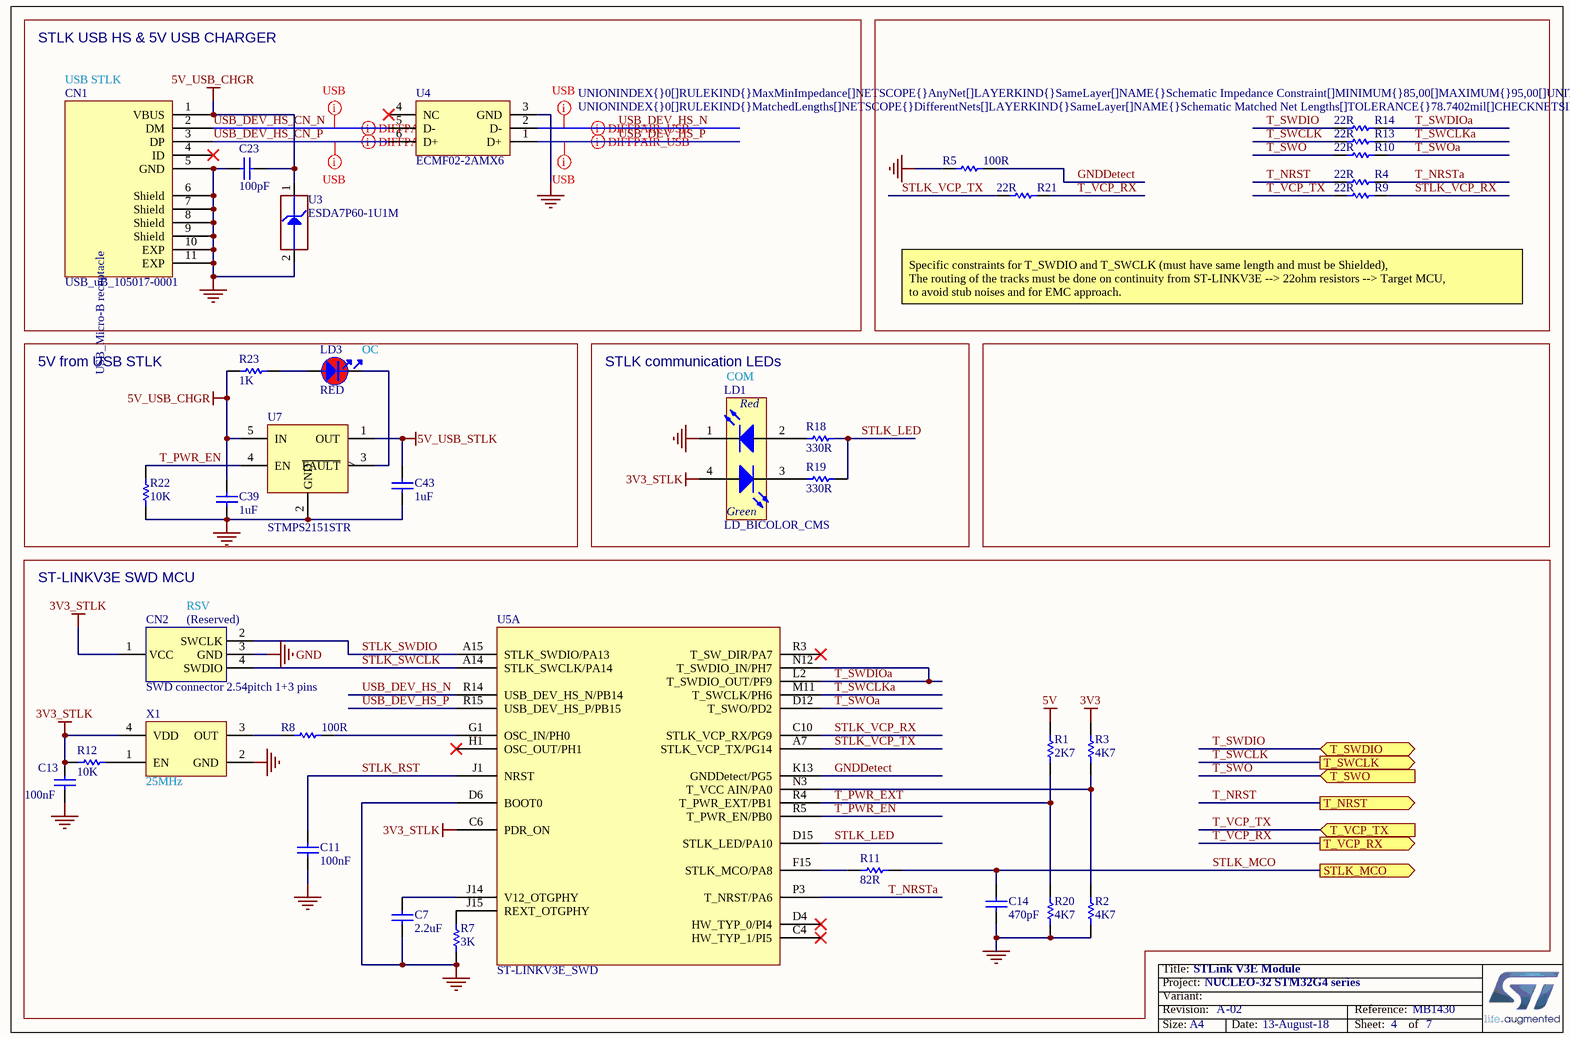
[diagram p5: STLink_V3E_Module.SchDoc]

### Parts
C7  value 2.2uF  [C0603]
C11  value 100nF  [C0402]
C13  value 100nF  [C0402]
C14  value 470pF  [C0402]  (hidden comment: Capacitor)
C23  value 100pF  [C0402]
C39  value 1uF  [C0603]
C43  value 1uF  [C0603]
CN1  value USB_uB_105017-0001  [CON_USBMICROB_MOLEX_105017-0001_H2P90]
CN2  value SWD connector 2.54pitch 1+3 pins  [CON_SAMTEC_TSW-103-07-X-D_CUSTOM_4PINS__V1-3]
LD1  value LD_BICOLOR_CMS  [LED_BI-GR_HSMF-A201-A00J1]
LD3  value RED  [LED_0603_RED_H0P4]
R1  value 2K7  [R0402]
R2  value 4K7  [R0402]
R3  value 4K7  [R0402]
R4  value 22R  [R0402]
R5  value 100R  [R0402]
R7  value 3K  [R0402]
R8  value 100R  [R0402]
R9  value 22R  [R0402]
R10  value 22R  [R0402]
R11  value 82R  [R0402]  (hidden comment: Resistor)
R12  value 10K  [R0402]
R13  value 22R  [R0402]
R14  value 22R  [R0402]
R18  value 330R  [R0603]
R19  value 330R  [R0603]
R20  value 4K7  [R0402]
R21  value 22R  [R0402]
R22  value 10K  [R0402]
R23  value 1K  [R0603]
U3  value ESDA7P60-1U1M  [ESD_QFN2_1P6X1_P125]
U4  value ECMF02-2AMX6  [ESD_QFN-6L_1P7X1P5_P050]
U5  value ST-LINKV3E_SWD  [ICC_UFBGA201_176+25_10X10_P065]  (part A of 2)
U7  value STMPS2151STR  [MOS_SOT23-5L]
X1  value 25MHz  [OSC_NDK_NZ2520SB_4P]

### Blocks framed on the sheet
STLK USB HS & 5V USB CHARGER: C23 CN1 U3 U4
5V from USB STLK: C39 C43 LD3 R22 R23 U7
STLK communication LEDs: LD1 R18 R19
ST-LINKV3E SWD MCU: C7 C11 C13 C14 CN2 R1-R3 R7 R8 R11 R12 R20 U5 X1

### Ports
STLK_MCO, T_NRST, T_SWCLK, T_SWDIO, T_SWO, T_VCP_RX, T_VCP_TX

### Nets
3V3: R3.2
3V3_STLK: C13.2 CN2.1(VCC) LD1.4(YellowGreen_anode) R12.1 U5.C6(PDR_ON) X1.4(VDD)
5V: R1.2
5V_USB_CHGR: C23.2 C39.2 CN1.1(VBUS) R23.1 U3.1(IO1) U7.5(IN)
5V_USB_STLK: C43.2 U7.1(OUT)
GND: C7.1 C11.1 C13.1 C14.1 C23.1 C39.1 C43.1 CN1.5(GND) CN1.6(Shield) CN1.7(Shield) CN1.8(Shield) CN1.9(Shield) CN1.10(EXP) CN1.11(EXP) CN2.3(GND) LD1.1(RED_cathode) R2.1 R5.1 R7.1 R20.1 R22.1 U3.2(GND) U4.3(GND) U5.D6(BOOT0) U7.2(GND) X1.2(GND)
GNDDetect: R5.2 U5.K13(GNDDetect/PG5)
STLK_LED: R18.2 R19.2 U5.D15(STLK_LED/PA10)
STLK_MCO: C14.2 R11.2 ; port STLK_MCO
STLK_RST: C11.2 U5.J1(NRST)
STLK_SWCLK: CN2.4(SWDIO) U5.A14(STLK_SWCLK/PA14)
STLK_SWDIO: CN2.2(SWCLK) U5.A15(STLK_SWDIO/PA13)
STLK_VCP_RX: R9.2 U5.C10(STLK_VCP_RX/PG9)
STLK_VCP_TX: R21.1 U5.A7(STLK_VCP_TX/PG14)
T_NRST: R4.1 ; port T_NRST
T_NRSTa: R4.2 U5.P3(T_NRST/PA6)
T_PWR_EN: R22.2 U5.R5(T_PWR_EN/PB0) U7.4(EN)
T_PWR_EXT: R1.1 R20.2 U5.R4(T_PWR_EXT/PB1)
T_SWCLK: R13.1 ; port T_SWCLK
T_SWCLKa: R13.2 U5.M11(T_SWCLK/PH6)
T_SWDIO: R14.1 ; port T_SWDIO
T_SWDIOa: R14.2 U5.L2(T_SWDIO_OUT/PF9) U5.N12(T_SWDIO_IN/PH7)
T_SWO: R10.1 ; port T_SWO
T_SWOa: R10.2 U5.D12(T_SWO/PD2)
T_VCP_RX: R21.2 ; port T_VCP_RX
T_VCP_TX: R9.1 ; port T_VCP_TX
USB_DEV_HS_CN_N: CN1.2(DM) U4.5(D-)
USB_DEV_HS_CN_P: CN1.3(DP) U4.6(D+)
USB_DEV_HS_N: U4.2(D-) U5.R14(USB_DEV_HS_N/PB14)
USB_DEV_HS_P: U4.1(D+) U5.R15(USB_DEV_HS_P/PB15)
NetC7_2: C7.2 U5.J14(V12_OTGPHY)
NetLD1_2: LD1.2(Red_anode) R18.1
NetLD1_3: LD1.3(YellowGreen_cathode) R19.1
NetLD3_1: LD3.1 R23.2
NetLD3_2: LD3.2 U7.3(~{FAULT})
NetR2_2: R2.2 R3.1 U5.N3(T_VCC_AIN/PA0)
NetR7_2: R7.2 U5.J15(REXT_OTGPHY)
NetR8_1: R8.1 X1.3(OUT)
NetR8_2: R8.2 U5.G1(OSC_IN/PH0)
NetR11_1: R11.1 U5.F15(STLK_MCO/PA8)
NetR12_2: R12.2 X1.1(EN)

Not connected (* = marked no-connect by the designer): CN1 4(ID)*; U4 4(NC)*; U5 C4(HW_TYP_1/PI5)* D4(HW_TYP_0/PI4)* H1(OSC_OUT/PH1)* R3(T_SW_DIR/PA7)*

### Layout directives
differential pair; rule Impedance Constraint [Min = 85.00    Max = 95.00    ]: USB_DEV_HS_CN_N, USB_DEV_HS_CN_P, USB_DEV_HS_N, USB_DEV_HS_P
rule Undefined; rule Matched Net Lengths [Tolerance = 2mm]; rule Impedance Constraint [Min = 85.00    Max = 95.00    ]: USB_DEV_HS_CN_N, USB_DEV_HS_CN_P, USB_DEV_HS_N, USB_DEV_HS_P

### Notes on the sheet
- USB STLK
- Specific constraints for T_SWDIO and T_SWCLK (must have same length and must be Shielded),
  The routing of the tracks must be done on continuity from ST-LINKV3E --> 22ohm resistors --> Target MCU,
  to avoid stub noises and for EMC approach.
- (near LD3) OC
- COM
- (near CN2) (Reserved)
- (near CN2) RSV
- Title:
- Project:
- Size:
- Revision:
- Variant:
- A4
- -
- Date:
- Reference:
- Sheet:
- of
- (in symbol MCD-00028) USB_Micro-B receptacle
- (in symbol MCD-00051) Red; Green

### Library data of the parts
C7 = MCD-00012: as C1 on sheet Power; Internal_Part_Number: MCD-00012; Status: Released; Package: C0603; ComponentLink1Description: Datasheet; Part_Type: Capacitor; ComponentLink1URL: http://tunmcdsvn.tun.st.com/Component_Datasheet_Library/Trunk/Capacitors/Yageo_Multilayer_capacitor_X5R_series_100pF_to_100uF
C11 C13 = MCD-00102: as C2 on sheet Power; Internal_Part_Number: MCD-00102; Status: Released; Package: C0402; ComponentLink1Description: Datasheet; Part_Type: Capacitor; ComponentLink1URL: http://tunmcdsvn.tun.st.com/Component_Datasheet_Library/Trunk/Capacitors/Yageo_Multilayer_Capacitor_X7R_series_100pF_to_22uF
C14 = MCD-00724: Capacitor, MLCC, 470pF, 50V, NPO, 5%, 0402, T=0,5mm; Manufacturer_Part_Number: CC0402JRNPO9BN471; Manufacturer: YAGEO; Provided_By: SUBCO; Internal_Part_Number: MCD-00724; Status: Released; Part_Type: Capacitor; Package: C0402; ComponentLink1Description: Datasheet; ComponentLink1URL: http://tunmcdsvn.tun.st.com/Component_Datasheet_Library/Trunk/Capacitors/Yageo_Capacitor_NP0_16V-to-50V
C23 = MCD-00205: Capacitor, MLCC, 100pF, 50V, NPO, 5%, 0402, T=0,5mm; Manufacturer_Part_Number: CC0402JRNPO9BN101; Manufacturer: YAGEO; Provided_By: SUBCO; Initial_Board_Reference: MB1361; Internal_Part_Number: MCD-00205; Status: Released; Part_Type: Capacitor; Package: C0402; ComponentLink1Description: Datasheet; ComponentLink1URL: http://tunmcdsvn.tun.st.com/Component_Datasheet_Library/Trunk/Capacitors/Yageo_Capacitor_NP0_16V-to-50V
C39 C43 = MCD-00010: as C10 on sheet Power; Internal_Part_Number: MCD-00010; Status: Released; Package: C0603; ComponentLink1Description: Datasheet; Part_Type: Capacitor; ComponentLink1URL: http://tunmcdsvn.tun.st.com/Component_Datasheet_Library/Trunk/Capacitors/Yageo_Multilayer_capacitor_X5R_series_100pF_to_100uF
CN1 = MCD-00028: USB-MICRO-B, 0.65mm, RA, SMT, Bottom Mount,; Manufacturer_Part_Number: 1050170001; Manufacturer: MOLEX; Part_Type: Connector; Provided_By: SUBCO; Initial_Board_Reference: MB1274; Internal_Part_Number: MCD-00028; Status: Released; ComponentLink1Description: Datasheet; ComponentLink1URL: http://tunmcdsvn.tun.st.com/Component_Datasheet_Library/Trunk/Connectors/Molex_Connector-USB-microB_105017-0001
CN2 = MCD-01430: SWD connector 2.54pitch 1+3 pins - not fitted; Manufacturer_Part_Number: na; Initial_Board_Reference: MB1430; Internal_Part_Number: MCD-01430; Status: Checked; Part_Type: Connector; Manufacturer: na; ComponentLink1Description: Datasheet; ComponentLink1URL: http://tunmcdsvn.tun.st.com/Component_Datasheet_Library/Trunk/Connectors/Samtec_TSW-HTSW-series; Provided_By: n/a
LD1 = MCD-00051: LED Bicolor; Part_Type: Display; Manufacturer_Part_Number: HSMF-A201-A00J1; Manufacturer: AVAGO TECHNOLOGIES; Alternate_Manufacturer_Part_Number: LE-RGW35280; Alternate_Manufacturer: EVERLUCK; Provided_By: SUBCO; Initial_Board_Reference: MB1274; Internal_Part_Number: MCD-00051; Status: Released; ComponentLink1Description: Datasheet; ComponentLink1URL: http://tunmcdsvn.tun.st.com/Component_Datasheet_Library/Trunk/Display/Avago_LED-SMC_HSMx-A2xx-02Feb2012
LD3 = MCD-00322: LED, Red, 0603; Part_Type: Display; Manufacturer_Part_Number: 19-217/R6C-AL1M2VY/3T; Manufacturer: EVERLIGHT; Provided_By: SUBCO; Initial_Board_Reference: MB1311; Internal_Part_Number: MCD-00322; Status: Released; Package: LED 0603; ComponentLink1Description: Datasheet; ComponentLink1URL: http://tunmcdsvn.tun.st.com/Component_Datasheet_Library/Trunk/Display/Everlight_SMD-LED-RED_19-213-R6C-AP1Q2B-3T-V3.doc
R1 = MCD-00055: Resistor,2K7,0402,1%,1/16W; Manufacturer_Part_Number: RC0402FR-072K7L; Manufacturer: YAGEO; Provided_By: SUBCO; Initial_Board_Reference: MB1274; Internal_Part_Number: MCD-00055; Status: Released; ComponentLink1Description: Datasheet; Part_Type: Resistor; Package: R0402; ComponentLink1URL: http://tunmcdsvn.tun.st.com/Component_Datasheet_Library/Trunk/Resistors/Yageo_Resistor_RC0402-series
R2 R3 R20 = MCD-00065: Resistor,4K7,0402,1%,1/16W; Manufacturer_Part_Number: RC0402FR-074K7L; Manufacturer: YAGEO; Alternate_Manufacturer_Part_Number: RT0402FRE074K7L; Provided_By: SUBCO; Initial_Board_Reference: MB1274; Internal_Part_Number: MCD-00065; Status: Released; ComponentLink1Description: Datasheet; Alternate_Manufacturer: YAGEO; Part_Type: Resistor; Package: R0402; ComponentLink1URL: http://tunmcdsvn.tun.st.com/Component_Datasheet_Library/Trunk/Resistors/Yageo_Resistor_RC0402-series
R4 R9 R10 R13 R14 R21 = MCD-00189: Resistor,22R,0402,1%,1/16W; Manufacturer_Part_Number: RC0402FR-0722RL; Manufacturer: YAGEO; Provided_By: SUBCO; Initial_Board_Reference: MBxxxx; Internal_Part_Number: MCD-00189; Status: Released; Part_Type: Resistor; ComponentLink1Description: Datasheet; Package: R0402; ComponentLink1URL: http://tunmcdsvn.tun.st.com/Component_Datasheet_Library/Trunk/Resistors/Yageo_Resistor_RC0402-series
R5 R8 = MCD-00119: Resistor,100R,0402,1%,1/16W; Manufacturer_Part_Number: RC0402FR-07100RL; Manufacturer: YAGEO; Provided_By: SUBCO; Initial_Board_Reference: MB1262; Internal_Part_Number: MCD-00119; Status: Released; Part_Type: Resistor; ComponentLink1Description: Datasheet; Package: R0402; ComponentLink1URL: http://tunmcdsvn.tun.st.com/Component_Datasheet_Library/Trunk/Resistors/Yageo_Resistor_RC0402-series
R7 = MCD-00185: Resistor,3K,0402,1%,1/16W; Manufacturer_Part_Number: RC0402FR-073KL; Manufacturer: YAGEO; Provided_By: SUBCO; Initial_Board_Reference: MBxxxx; Internal_Part_Number: MCD-00185; Status: Released; ComponentLink1Description: Datasheet; Part_Type: Resistor; Package: R0402; ComponentLink1URL: http://tunmcdsvn.tun.st.com/Component_Datasheet_Library/Trunk/Resistors/Yageo_Resistor_RC0402-series
R11 = MCD-00525: Resistor,82R,0402,1%,1/16W; Manufacturer_Part_Number: RC0402FR-0782RL; Manufacturer: YAGEO; Provided_By: SUBCO; Internal_Part_Number: MCD-00525; Status: Released; Part_Type: Resistor; Package: R0402; ComponentLink1Description: Datasheet; ComponentLink1URL: http://tunmcdsvn.tun.st.com/Component_Datasheet_Library/Trunk/Resistors/Yageo_Resistor_RC0402-series
R12 R22 = MCD-00053: as R6 on sheet Power; Internal_Part_Number: MCD-00053; Status: Released; ComponentLink1Description: Datasheet; Part_Type: Resistor; Package: R0402; ComponentLink1URL: http://tunmcdsvn.tun.st.com/Component_Datasheet_Library/Trunk/Resistors/Yageo_Resistor_RC0402-series
R18 R19 = MCD-00197: Resistor,330R,0603,1%,1/10W; Manufacturer_Part_Number: RC0603FR-07330RL; Manufacturer: YAGEO; Provided_By: SUBCO; Initial_Board_Reference: MBxxxx; Internal_Part_Number: MCD-00197; Status: Released; ComponentLink1Description: Datasheet; Part_Type: Resistor; Package: R0603; ComponentLink1URL: http://tunmcdsvn.tun.st.com/Component_Datasheet_Library/Trunk/Resistors/Yageo_Resistor_RC0603-series
R23 = MCD-00070: Resistor,1K,0603,1%,1/10W; Manufacturer_Part_Number: RC0603FR-071KL; Manufacturer: YAGEO; Provided_By: SUBCO; Initial_Board_Reference: MB1274; Internal_Part_Number: MCD-00070; Status: Released; ComponentLink1Description: Datasheet; Part_Type: Resistor; Package: R0603; ComponentLink1URL: http://tunmcdsvn.tun.st.com/Component_Datasheet_Library/Trunk/Resistors/Yageo_Resistor_RC0603-series
U3 = MCD-00251: High power transient voltage suppressor, 7V breakdown; Part_Type: Diode; Manufacturer: STMICROELECTRONICS; BMS_Part_Number: 9179042; Provided_By: SUBCO with ST control; Initial_Board_Reference: MB1311; Internal_Part_Number: MCD-00251; Status: Released; Manufacturer_Part_Number: ESDA7P60-1U1M; ComponentLink1Description: Datasheet; ComponentLink1URL: http://tunmcdsvn.tun.st.com/Component_Datasheet_Library/Trunk/Diodes/STM_ESD_ESDA7P60-1U1M
U4 = MCD-00649: Common mode filter with ESD protection for USB 2.0 interface; Part_Type: Diode; Manufacturer: STMICROELECTRONICS; Provided_By: SUBCO with ST control; Initial_Board_Reference: MB1248; Internal_Part_Number: MCD-00649; Status: Checked; Manufacturer_Part_Number: ECMF02-2AMX6; ComponentLink1Description: Datasheet; ComponentLink1URL: http://tunmcdsvn.tun.st.com/Component_Datasheet_Library/Trunk/Diodes/STM_ESD_ECMF02-2AMX6
U5 = MCD-00596: as U5 on sheet Power; Internal_Part_Number: MCD-00596; Status: Checked; ComponentLink1Description: Datasheet; ComponentLink1URL: http://tunmcdsvn.tun.st.com/Component_Datasheet_Library/Trunk/IC/BGA176+25L_10x10x0.6_pitch0.65
U7 = MCD-00159: 500mA, Enhanced single channel power switches with active high enable pin; Part_Type: IC; Manufacturer: STMICROELECTRONICS; Alternate_Manufacturer_Part_Number: TPS2051C; Alternate_Manufacturer: TEXAS INSTRUMENTS; BMS_Part_Number: 9159009; Provided_By: SUBCO with ST control; Initial_Board_Reference: MB1264; Internal_Part_Number: MCD-00159; Status: Checked; Manufacturer_Part_Number: STMPS2151STR; ComponentLink1Description: Datasheet; ComponentLink1URL: http://tunmcdsvn.tun.st.com/Component_Datasheet_Library/Trunk/IC/STM_PWR-Switch_STMPS2151STR
X1 = MCD-00597: Oscillator 25.00Mhz, -+50PPM, 3.3V, Temp -55 to +125°C; Manufacturer_Part_Number: NZ2520SB 25MHz END4869B; Manufacturer: NDK; Alternate_Manufacturer_Part_Number: KC2520B25.0000C10E00; Alternate_Manufacturer: AVX CORP/KYOCERA CORP; Part_Type: Crystal_Osc; BMS_Part_Number: 9157031; Provided_By: ST; Initial_Board_Reference: MB1331; Internal_Part_Number: MCD-00597; Status: Checked; ComponentLink1Description: Datasheet; ComponentLink1URL: http://tunmcdsvn.tun.st.com/Component_Datasheet_Library/Trunk/Crystal_Osc/NDK_OSCILLATOR_NZ2520SB; Order_Code_Digikey: 478-4780-1-ND

## Sheet Mechanical.SchDoc: Mechanical
size A4; Date: Not used; ApprovedBy: Not used; CheckedBy: Not used; Author: Not used; CompanyName: STMicroelectronics; DrawnBy: Not used; Engineer: Not used; Organization: Not used; Address1: Not used; Address2: Not used; Address3: Not used; Address4: Not used; DocumentNumber: Not used; Revision: Not used; SheetNumber: 7; SheetTotal: 7; CurrentTime: Not used; CurrentDate: Not used; Time: Not used; DocumentFullPathAndName: Not used; DocumentName: Not used; ModifiedDate: Not used; ImagePath: Not used; ProjectName: Not used; Application_BuildNumber: Not used
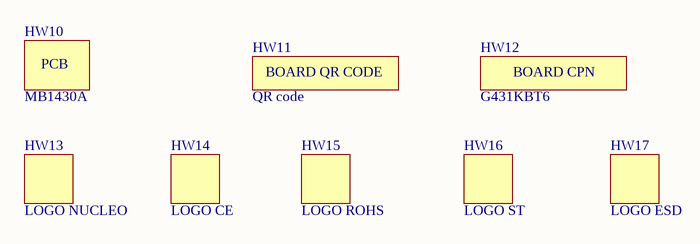
[diagram p6: Mechanical.SchDoc]

### Parts
HW10  value MB1430A  (mechanical)
HW11  value QR code  [STICKER_BOARD-QR-CODE_9X9]  (hidden comment: STICKER_BOARD-QR-CODE)  (mechanical)
HW12  value G431KBT6  [STICKER_BOARD-CPN_13X3]  (hidden comment: STICKER_BOARD_CPN)  (mechanical)
HW13  value LOGO NUCLEO  [LOGO_NUCLEO]  (no BOM)
HW14  value LOGO CE  [LOGO_CE]  (no BOM)
HW15  value LOGO ROHS  [LOGO_ROHS]  (no BOM)
HW16  value LOGO ST  [LOGO_ST]  (no BOM)
HW17  value LOGO ESD  [LOGO_MAIN_1]  (no BOM)

### Notes on the sheet
- Title:
- Project:
- Size:
- Revision:
- Variant:
- A4
- -
- Date:
- Reference:
- Sheet:
- of
- (in symbol MCD-01470) BOARD CPN
- (in symbol MCD-01471) BOARD QR CODE

### Library data of the parts
HW10 = MCD-00216: PCB, xxxx for PCB number, Y for PCB revision; Part_Type: Mechanical; Provided_By: SUBCO; Initial_Board_Reference: MB1319; Internal_Part_Number: MCD-00216; Status: Released; ComponentLink1Description: Datasheet; Manufacturer_Part_Number: n/a; Manufacturer: n/a
HW11 = MCD-01471: Sticker to mention QR code on small board size (ie Nucleo-32); Part_Type: Mechanical; Provided_By: SUBCO; Initial_Board_Reference: MB1430; Internal_Part_Number: MCD-01471; Status: Footprint available; Manufacturer_Part_Number: n/a; Manufacturer: n/a; ComponentLink1Description: Datasheet; ComponentLink1URL: n/a
HW12 = MCD-01470: Small sticker to mention board CPN (6 digits CPN + last ones FG); Part_Type: Mechanical; Provided_By: SUBCO; Initial_Board_Reference: MB1430; Internal_Part_Number: MCD-01470; Status: Footprint available; Manufacturer_Part_Number: n/a; Manufacturer: n/a; ComponentLink1Description: Datasheet; ComponentLink1URL: n/a
HW13 = MCD-00636: NUCLEO logo footprint for PCB; Part_Type: Mechanical; Initial_Board_Reference: MB1331; Internal_Part_Number: MCD-00636; Status: Released; Provided_By: n/a; ComponentLink1Description: Datasheet
HW14 = MCD-00626: CE logo footprint for PCB; Part_Type: Mechanical; Initial_Board_Reference: MB1331; Internal_Part_Number: MCD-00626; Status: Released; Provided_By: n/a; ComponentLink1Description: Datasheet
HW15 = MCD-00628: ROHS logo footprint for PCB; Part_Type: Mechanical; Initial_Board_Reference: MB1331; Internal_Part_Number: MCD-00628; Status: Released; Provided_By: n/a; ComponentLink1Description: Datasheet
HW16 = MCD-00625: STMicroelectronics logo footprint for PCB; Part_Type: Mechanical; Initial_Board_Reference: MB1331; Internal_Part_Number: MCD-00625; Status: Released; Provided_By: n/a; Manufacturer_Part_Number: n/a; Manufacturer: n/a; ComponentLink1Description: Datasheet; ComponentLink1URL: http://na
HW17 = MCD-00627: Hand ESD logo footprint for PCB; Part_Type: Mechanical; Initial_Board_Reference: MB1331; Internal_Part_Number: MCD-00627; Status: Released; Provided_By: n/a; Manufacturer_Part_Number: n/a; Manufacturer: n/a; ComponentLink1Description: Datasheet; ComponentLink1URL: http://na